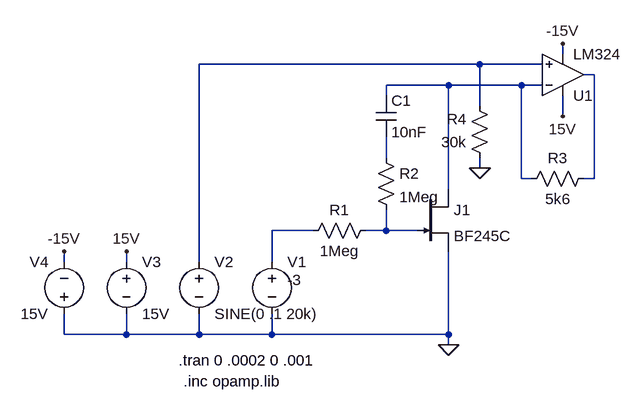
[diagram p0: schematic VCA circuit.asc]
VCA circuit.asc, the LTspice schematic file:
Version 4
SHEET 1 880 680
WIRE 448 -64 448 -80
WIRE 320 -48 -112 -48
WIRE 416 -48 320 -48
WIRE 496 -32 480 -32
WIRE 272 -16 176 -16
WIRE 384 -16 272 -16
WIRE 416 -16 384 -16
WIRE 176 0 176 -16
WIRE 320 16 320 -48
WIRE 448 32 448 0
WIRE 176 96 176 64
WIRE 320 112 320 96
WIRE 384 128 384 -16
WIRE 400 128 384 128
WIRE 496 128 496 -32
WIRE 496 128 480 128
WIRE 272 144 272 -16
WIRE 64 208 0 208
WIRE 176 208 176 176
WIRE 176 208 144 208
WIRE 224 208 176 208
WIRE -320 256 -320 240
WIRE -224 256 -224 240
WIRE -112 256 -112 -48
WIRE 0 256 0 208
WIRE -320 368 -320 336
WIRE -224 368 -224 336
WIRE -224 368 -320 368
WIRE -112 368 -112 336
WIRE -112 368 -224 368
WIRE 0 368 0 336
WIRE 0 368 -112 368
WIRE 272 368 272 240
WIRE 272 368 0 368
WIRE 272 384 272 368
FLAG 272 384 0
FLAG 448 32 15V
FLAG 448 -80 -15V
FLAG -224 240 15V
FLAG -320 240 -15V
FLAG 320 112 0
SYMBOL njf 224 144 R0
SYMATTR InstName J1
SYMATTR Value BF245C
SYMBOL voltage 0 240 R0
WINDOW 3 24 44 Left 2
WINDOW 123 0 0 Left 0
WINDOW 39 0 0 Left 0
SYMATTR Value -3
SYMATTR InstName V1
SYMBOL res 160 192 R90
WINDOW 0 0 56 VBottom 2
WINDOW 3 32 56 VTop 2
SYMATTR InstName R1
SYMATTR Value 1Meg
SYMBOL res 160 80 R0
SYMATTR InstName R2
SYMATTR Value 1Meg
SYMBOL cap 160 0 R0
SYMATTR InstName C1
SYMATTR Value 10nF
SYMBOL voltage -112 240 R0
WINDOW 123 0 0 Left 0
WINDOW 39 0 0 Left 0
SYMATTR InstName V2
SYMATTR Value SINE(0 .1 20k)
SYMBOL Opamps\\opamp2 448 32 M180
SYMATTR InstName U1
SYMATTR Value LM324
SYMBOL voltage -224 240 R0
WINDOW 123 0 0 Left 0
WINDOW 39 0 0 Left 0
SYMATTR InstName V3
SYMATTR Value 15V
SYMBOL voltage -320 352 R180
WINDOW 0 24 96 Left 2
WINDOW 3 24 16 Left 2
WINDOW 123 0 0 Left 0
WINDOW 39 0 0 Left 0
SYMATTR InstName V4
SYMATTR Value 15V
SYMBOL res 496 112 R90
WINDOW 0 0 56 VBottom 2
WINDOW 3 32 56 VTop 2
SYMATTR InstName R3
SYMATTR Value 5k6
SYMBOL res 336 112 R180
WINDOW 0 36 76 Left 2
WINDOW 3 36 40 Left 2
SYMATTR InstName R4
SYMATTR Value 30k
TEXT -144 408 Left 2 !.tran 0 .0002 0 .001
TEXT -136 440 Left 2 !.inc opamp.lib

The netlist it stands for:
* VCA circuit.asc
J1 N003 N006 0 BF245C
V1 N005 0 -3
R1 N006 N005 1Meg
R2 N004 N006 1Meg
C1 N003 N004 10nF
V2 N001 0 SINE(0 .1 20k)
XU1 N001 N003 15V -15V N002 LM324  ; pins In+ In- V+ V- OUT
V3 15V 0 15V
V4 0 -15V 15V
R3 N002 N003 5k6
R4 0 N001 30k
.model NJF NJF
.model PJF PJF
.lib standard.jft
.tran 0 .0002 0 .001
.inc opamp.lib
.backanno
.end